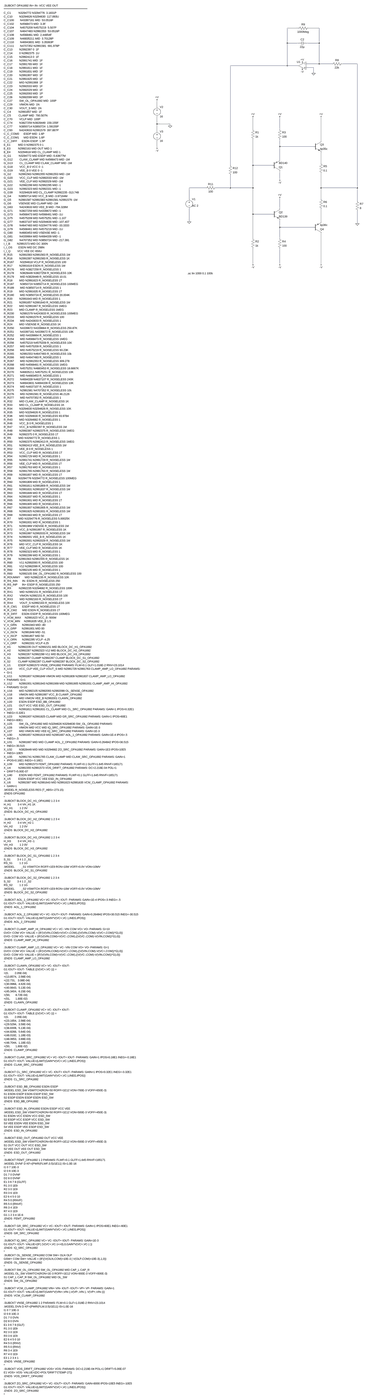
[diagram p0: schematic power stage with dc servo-AC.asc, whole sheet]
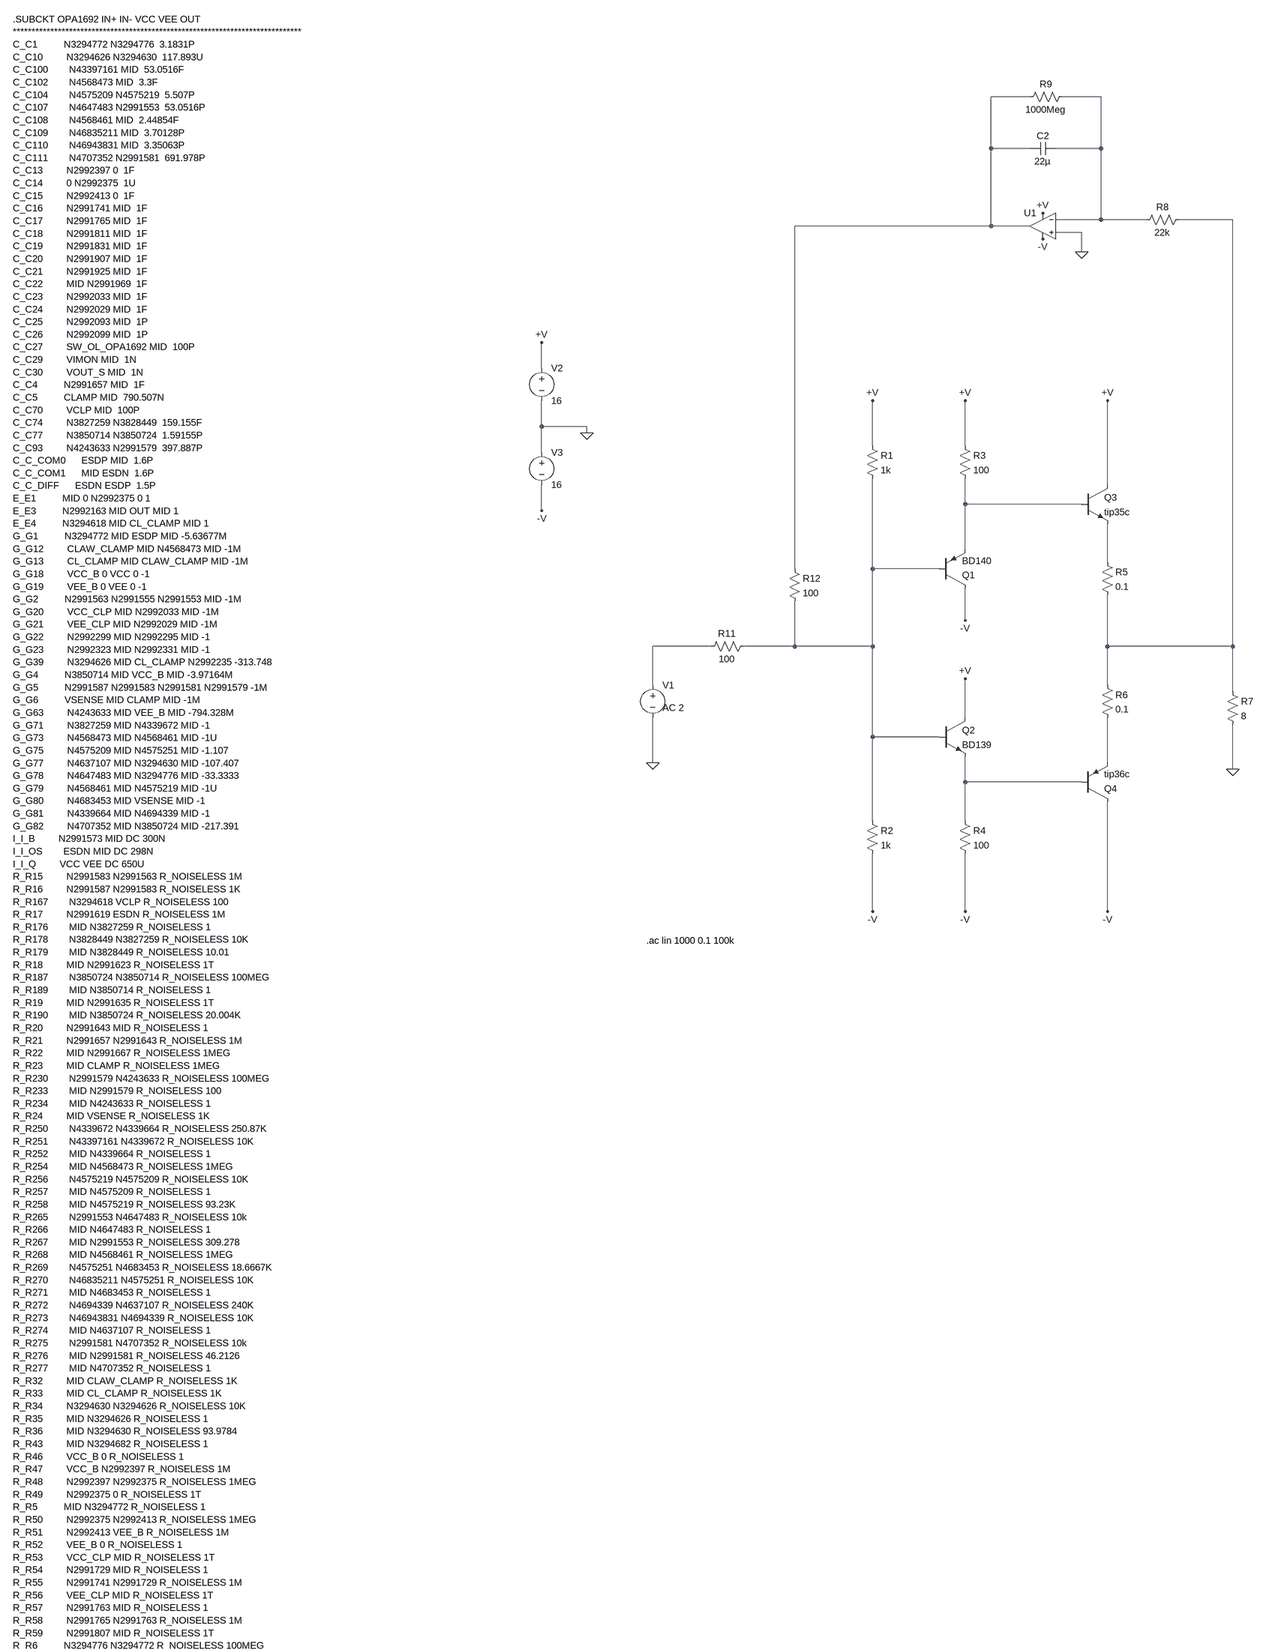
[diagram p1: schematic power stage with dc servo-AC.asc, part, row 1 of 3, column 1 of 1]
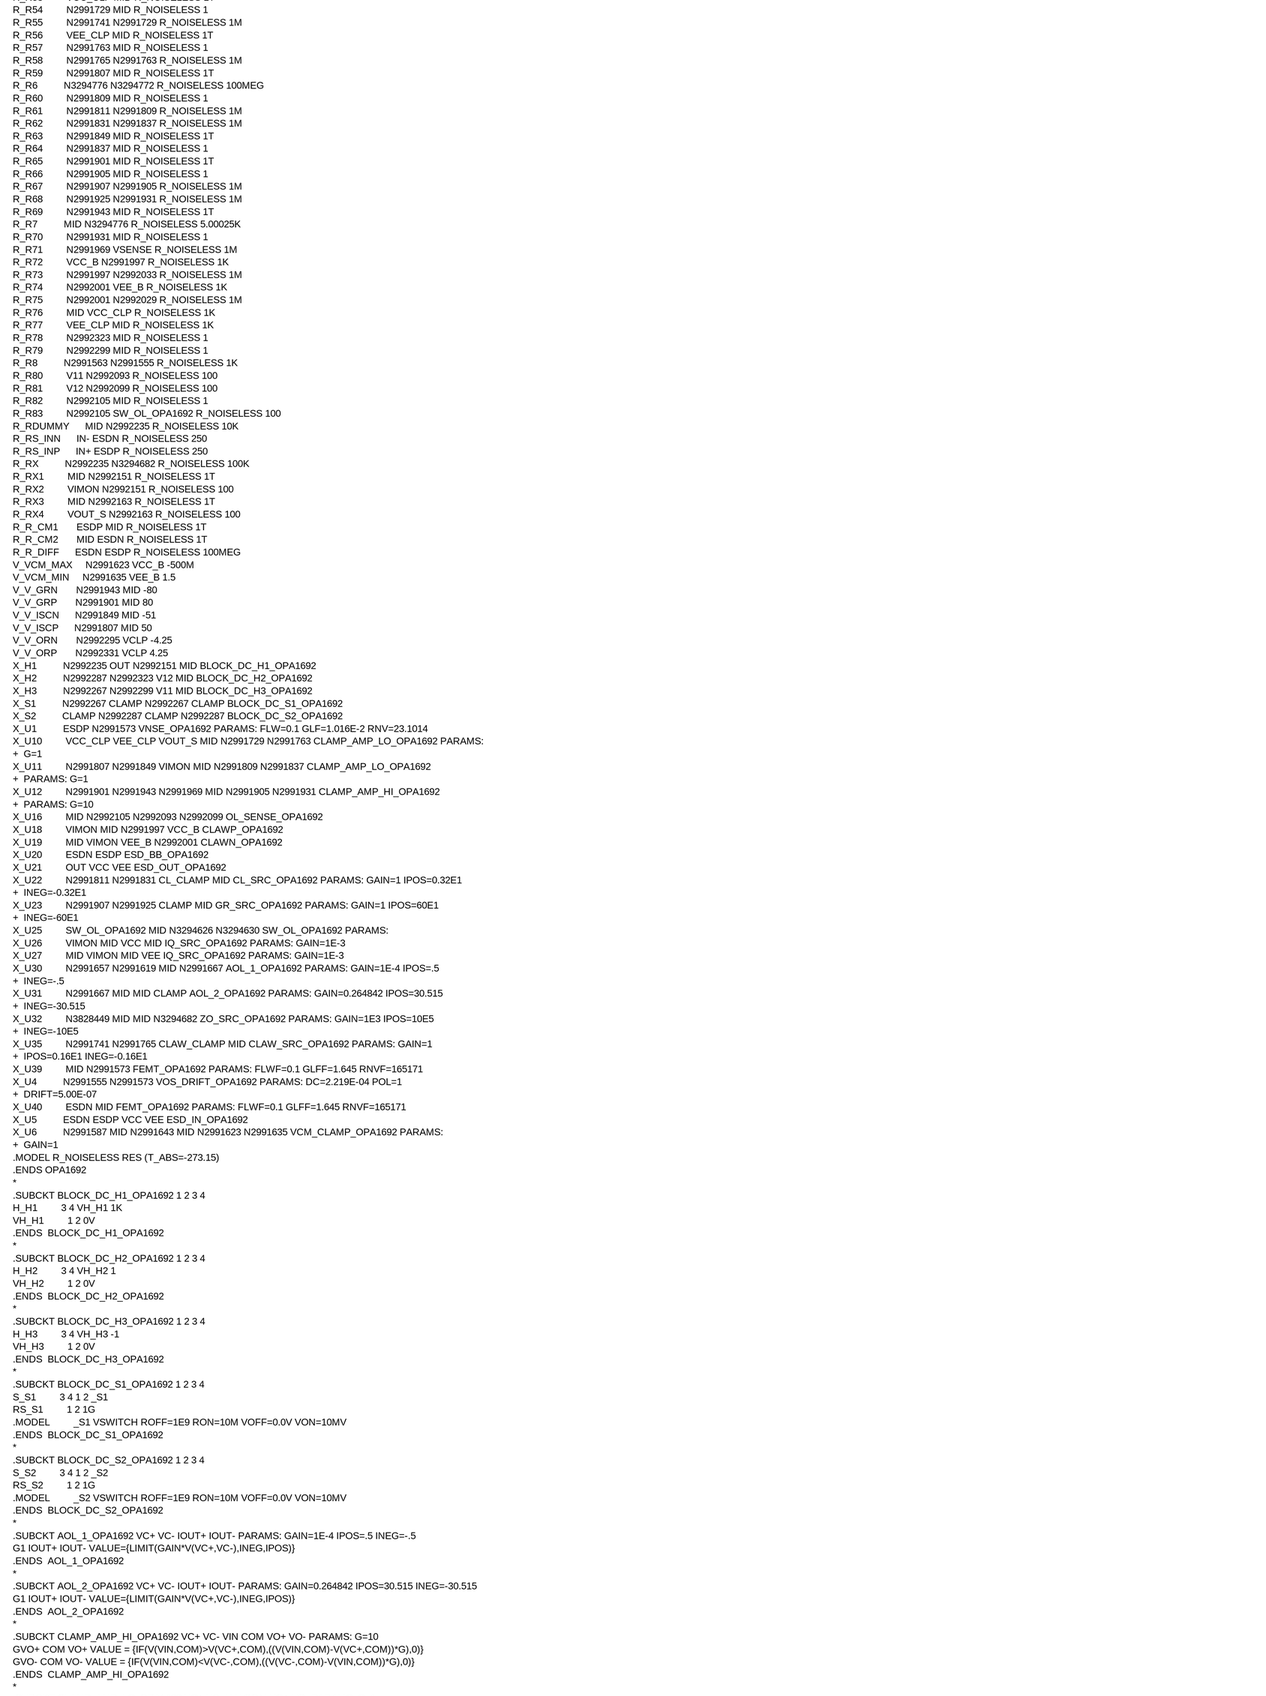
[diagram p2: schematic power stage with dc servo-AC.asc, part, row 2 of 3, column 1 of 1]
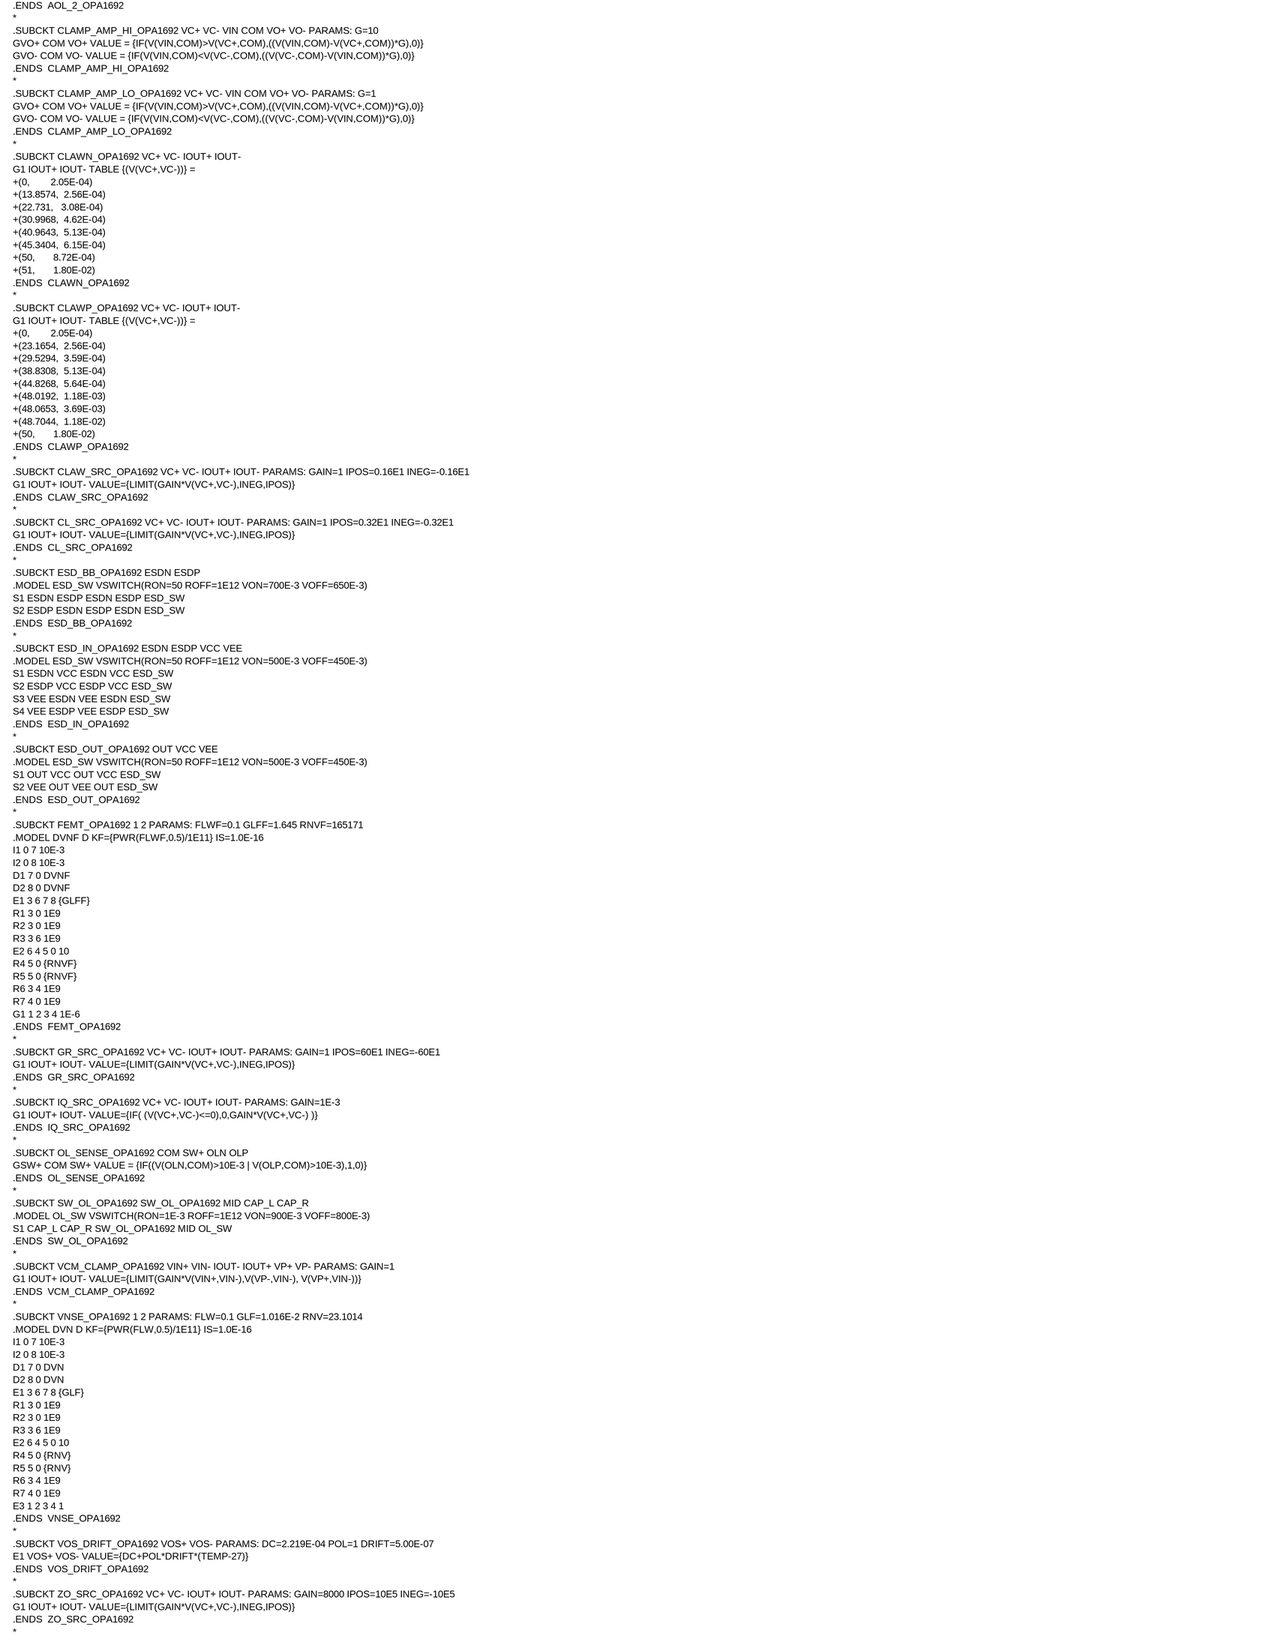
[diagram p3: schematic power stage with dc servo-AC.asc, part, row 3 of 3, column 1 of 1]
power stage with dc servo-AC.asc, the LTspice schematic file:
Version 4
SHEET 1 1560 8548
WIRE 720 -1888 624 -1888
WIRE 896 -1888 800 -1888
WIRE 624 -1760 624 -1888
WIRE 720 -1760 624 -1760
WIRE 896 -1760 896 -1888
WIRE 896 -1760 784 -1760
WIRE 896 -1584 896 -1760
WIRE 896 -1584 784 -1584
WIRE 1008 -1584 896 -1584
WIRE 1504 -1584 1088 -1584
WIRE 624 -1568 624 -1760
WIRE 624 -1568 -64 -1568
WIRE 720 -1568 624 -1568
WIRE 848 -1552 784 -1552
WIRE 848 -1504 848 -1552
WIRE -1408 -1216 -1408 -1280
WIRE -1408 -1072 -1408 -1136
WIRE -1296 -1072 -1408 -1072
WIRE -1296 -1056 -1296 -1072
WIRE 240 -1024 240 -1136
WIRE 560 -1024 560 -1136
WIRE -1408 -1008 -1408 -1072
WIRE 912 -928 912 -1136
WIRE 560 -880 560 -944
WIRE 848 -880 560 -880
WIRE -1408 -864 -1408 -928
WIRE 560 -768 560 -880
WIRE 912 -736 912 -832
WIRE -64 -720 -64 -1568
WIRE 240 -720 240 -944
WIRE 496 -720 240 -720
WIRE 560 -592 560 -672
WIRE -288 -528 -432 -528
WIRE -64 -528 -64 -640
WIRE -64 -528 -208 -528
WIRE 240 -528 240 -720
WIRE 240 -528 -64 -528
WIRE 912 -528 912 -656
WIRE 1504 -528 1504 -1584
WIRE 1504 -528 912 -528
WIRE -432 -432 -432 -528
WIRE 912 -432 912 -528
WIRE 1504 -416 1504 -528
WIRE 560 -352 560 -448
WIRE 240 -304 240 -528
WIRE 496 -304 240 -304
WIRE -432 -240 -432 -352
WIRE 912 -240 912 -352
WIRE 1504 -224 1504 -336
WIRE 560 -192 560 -256
WIRE 848 -192 560 -192
WIRE 240 -96 240 -304
WIRE 560 -96 560 -192
WIRE 240 128 240 -16
WIRE 560 128 560 -16
WIRE 912 128 912 -144
FLAG -432 -240 0
FLAG 240 -1136 +V
FLAG 560 -1136 +V
FLAG 240 128 -V
FLAG 560 128 -V
FLAG 560 -592 -V
FLAG 560 -448 +V
FLAG 912 -1136 +V
FLAG 912 128 -V
FLAG 1504 -224 0
FLAG -1296 -1056 0
FLAG -1408 -1280 +V
FLAG -1408 -864 -V
FLAG 848 -1504 0
FLAG 752 -1600 +V
FLAG 752 -1536 -V
SYMBOL res 224 -1040 R0
SYMATTR InstName R1
SYMATTR Value 1k
SYMATTR SpiceLine tol=1 pwr=0.5
SYMBOL res 224 -112 R0
SYMATTR InstName R2
SYMATTR Value 1k
SYMATTR SpiceLine tol=1 pwr=0.5
SYMBOL pnp 496 -672 M180
SYMATTR InstName Q1
SYMATTR Value BD140
SYMBOL npn 496 -352 R0
SYMATTR InstName Q2
SYMATTR Value BD139
SYMBOL voltage -432 -448 R0
WINDOW 3 24 44 Left 2
WINDOW 123 24 72 Left 2
WINDOW 39 0 0 Left 0
SYMATTR Value ""
SYMATTR Value2 AC 2
SYMATTR InstName V1
SYMBOL res 544 -1040 R0
SYMATTR InstName R3
SYMATTR Value 100
SYMATTR SpiceLine tol=5 pwr=2
SYMBOL res 544 -112 R0
SYMATTR InstName R4
SYMATTR Value 100
SYMATTR SpiceLine tol=5 pwr=5
SYMBOL npn 848 -928 R0
SYMATTR InstName Q3
SYMATTR Value tip35c
SYMBOL pnp 848 -144 M180
SYMATTR InstName Q4
SYMATTR Value tip36c
SYMBOL res 896 -752 R0
SYMATTR InstName R5
SYMATTR Value 0.1
SYMBOL res 896 -448 R0
SYMATTR InstName R6
SYMATTR Value 0.1
SYMBOL res 1488 -432 R0
SYMATTR InstName R7
SYMATTR Value 8
SYMBOL voltage -1408 -1232 R0
WINDOW 123 0 0 Left 0
WINDOW 39 0 0 Left 0
SYMATTR InstName V2
SYMATTR Value 16
SYMBOL voltage -1408 -1024 R0
WINDOW 123 0 0 Left 0
WINDOW 39 0 0 Left 0
SYMATTR InstName V3
SYMATTR Value 16
SYMBOL OpAmps\\opamp2 752 -1632 M0
WINDOW 3 16 96 Invisible 2
SYMATTR Value OPA1692
SYMATTR InstName U1
SYMBOL res 1104 -1600 R90
WINDOW 0 0 56 VBottom 2
WINDOW 3 32 56 VTop 2
SYMATTR InstName R8
SYMATTR Value 22k
SYMBOL res 816 -1904 R90
WINDOW 0 0 56 VBottom 2
WINDOW 3 32 56 VTop 2
SYMATTR InstName R9
SYMATTR Value 1000Meg
SYMBOL cap 784 -1776 R90
WINDOW 0 0 32 VBottom 2
WINDOW 3 32 32 VTop 2
SYMATTR InstName C2
SYMATTR Value 22µ
SYMBOL res -192 -544 R90
WINDOW 0 0 56 VBottom 2
WINDOW 3 32 56 VTop 2
SYMATTR InstName R11
SYMATTR Value 100
SYMBOL res -80 -736 R0
SYMATTR InstName R12
SYMATTR Value 100
TEXT -448 200 Left 2 !.ac lin 1000 0.1 100k
TEXT -3000 -2080 Left 2 !.SUBCKT OPA1692 IN+ IN- VCC VEE OUT  \n*****************************************************************************\nC_C1          N3294772 N3294776  3.1831P   \nC_C10         N3294626 N3294630  117.893U   \nC_C100        N43397161 MID  53.0516F   \nC_C102        N4568473 MID  3.3F   \nC_C104        N4575209 N4575219  5.507P   \nC_C107        N4647483 N2991553  53.0516P   \nC_C108        N4568461 MID  2.44854F   \nC_C109        N46835211 MID  3.70128P   \nC_C110        N46943831 MID  3.35063P   \nC_C111        N4707352 N2991581  691.978P   \nC_C13         N2992397 0  1F   \nC_C14         0 N2992375  1U   \nC_C15         N2992413 0  1F   \nC_C16         N2991741 MID  1F   \nC_C17         N2991765 MID  1F   \nC_C18         N2991811 MID  1F   \nC_C19         N2991831 MID  1F   \nC_C20         N2991907 MID  1F   \nC_C21         N2991925 MID  1F   \nC_C22         MID N2991969  1F   \nC_C23         N2992033 MID  1F   \nC_C24         N2992029 MID  1F   \nC_C25         N2992093 MID  1P   \nC_C26         N2992099 MID  1P   \nC_C27         SW_OL_OPA1692 MID  100P   \nC_C29         VIMON MID  1N   \nC_C30         VOUT_S MID  1N   \nC_C4          N2991657 MID  1F   \nC_C5          CLAMP MID  790.507N   \nC_C70         VCLP MID  100P   \nC_C74         N3827259 N3828449  159.155F   \nC_C77         N3850714 N3850724  1.59155P   \nC_C93         N4243633 N2991579  397.887P   \nC_C_COM0      ESDP MID  1.6P   \nC_C_COM1      MID ESDN  1.6P   \nC_C_DIFF      ESDN ESDP  1.5P   \nE_E1          MID 0 N2992375 0 1\nE_E3          N2992163 MID OUT MID 1\nE_E4          N3294618 MID CL_CLAMP MID 1\nG_G1          N3294772 MID ESDP MID -5.63677M\nG_G12         CLAW_CLAMP MID N4568473 MID -1M\nG_G13         CL_CLAMP MID CLAW_CLAMP MID -1M\nG_G18         VCC_B 0 VCC 0 -1\nG_G19         VEE_B 0 VEE 0 -1\nG_G2          N2991563 N2991555 N2991553 MID -1M\nG_G20         VCC_CLP MID N2992033 MID -1M\nG_G21         VEE_CLP MID N2992029 MID -1M\nG_G22         N2992299 MID N2992295 MID -1\nG_G23         N2992323 MID N2992331 MID -1\nG_G39         N3294626 MID CL_CLAMP N2992235 -313.748\nG_G4          N3850714 MID VCC_B MID -3.97164M\nG_G5          N2991587 N2991583 N2991581 N2991579 -1M\nG_G6          VSENSE MID CLAMP MID -1M\nG_G63         N4243633 MID VEE_B MID -794.328M\nG_G71         N3827259 MID N4339672 MID -1\nG_G73         N4568473 MID N4568461 MID -1U\nG_G75         N4575209 MID N4575251 MID -1.107\nG_G77         N4637107 MID N3294630 MID -107.407\nG_G78         N4647483 MID N3294776 MID -33.3333\nG_G79         N4568461 MID N4575219 MID -1U\nG_G80         N4683453 MID VSENSE MID -1\nG_G81         N4339664 MID N4694339 MID -1\nG_G82         N4707352 MID N3850724 MID -217.391\nI_I_B         N2991573 MID DC 300N  \nI_I_OS        ESDN MID DC 298N  \nI_I_Q         VCC VEE DC 650U  \nR_R15         N2991583 N2991563 R_NOISELESS 1M\nR_R16         N2991587 N2991583 R_NOISELESS 1K\nR_R167        N3294618 VCLP R_NOISELESS 100\nR_R17         N2991619 ESDN R_NOISELESS 1M\nR_R176        MID N3827259 R_NOISELESS 1\nR_R178        N3828449 N3827259 R_NOISELESS 10K\nR_R179        MID N3828449 R_NOISELESS 10.01\nR_R18         MID N2991623 R_NOISELESS 1T\nR_R187        N3850724 N3850714 R_NOISELESS 100MEG\nR_R189        MID N3850714 R_NOISELESS 1\nR_R19         MID N2991635 R_NOISELESS 1T\nR_R190        MID N3850724 R_NOISELESS 20.004K\nR_R20         N2991643 MID R_NOISELESS 1\nR_R21         N2991657 N2991643 R_NOISELESS 1M\nR_R22         MID N2991667 R_NOISELESS 1MEG\nR_R23         MID CLAMP R_NOISELESS 1MEG\nR_R230        N2991579 N4243633 R_NOISELESS 100MEG\nR_R233        MID N2991579 R_NOISELESS 100\nR_R234        MID N4243633 R_NOISELESS 1\nR_R24         MID VSENSE R_NOISELESS 1K\nR_R250        N4339672 N4339664 R_NOISELESS 250.87K\nR_R251        N43397161 N4339672 R_NOISELESS 10K\nR_R252        MID N4339664 R_NOISELESS 1\nR_R254        MID N4568473 R_NOISELESS 1MEG\nR_R256        N4575219 N4575209 R_NOISELESS 10K\nR_R257        MID N4575209 R_NOISELESS 1\nR_R258        MID N4575219 R_NOISELESS 93.23K\nR_R265        N2991553 N4647483 R_NOISELESS 10k\nR_R266        MID N4647483 R_NOISELESS 1\nR_R267        MID N2991553 R_NOISELESS 309.278\nR_R268        MID N4568461 R_NOISELESS 1MEG\nR_R269        N4575251 N4683453 R_NOISELESS 18.6667K\nR_R270        N46835211 N4575251 R_NOISELESS 10K\nR_R271        MID N4683453 R_NOISELESS 1\nR_R272        N4694339 N4637107 R_NOISELESS 240K\nR_R273        N46943831 N4694339 R_NOISELESS 10K\nR_R274        MID N4637107 R_NOISELESS 1\nR_R275        N2991581 N4707352 R_NOISELESS 10k\nR_R276        MID N2991581 R_NOISELESS 46.2126\nR_R277        MID N4707352 R_NOISELESS 1\nR_R32         MID CLAW_CLAMP R_NOISELESS 1K\nR_R33         MID CL_CLAMP R_NOISELESS 1K\nR_R34         N3294630 N3294626 R_NOISELESS 10K\nR_R35         MID N3294626 R_NOISELESS 1\nR_R36         MID N3294630 R_NOISELESS 93.9784\nR_R43         MID N3294682 R_NOISELESS 1\nR_R46         VCC_B 0 R_NOISELESS 1\nR_R47         VCC_B N2992397 R_NOISELESS 1M\nR_R48         N2992397 N2992375 R_NOISELESS 1MEG\nR_R49         N2992375 0 R_NOISELESS 1T\nR_R5          MID N3294772 R_NOISELESS 1\nR_R50         N2992375 N2992413 R_NOISELESS 1MEG\nR_R51         N2992413 VEE_B R_NOISELESS 1M\nR_R52         VEE_B 0 R_NOISELESS 1\nR_R53         VCC_CLP MID R_NOISELESS 1T\nR_R54         N2991729 MID R_NOISELESS 1\nR_R55         N2991741 N2991729 R_NOISELESS 1M\nR_R56         VEE_CLP MID R_NOISELESS 1T\nR_R57         N2991763 MID R_NOISELESS 1\nR_R58         N2991765 N2991763 R_NOISELESS 1M\nR_R59         N2991807 MID R_NOISELESS 1T\nR_R6          N3294776 N3294772 R_NOISELESS 100MEG\nR_R60         N2991809 MID R_NOISELESS 1\nR_R61         N2991811 N2991809 R_NOISELESS 1M\nR_R62         N2991831 N2991837 R_NOISELESS 1M\nR_R63         N2991849 MID R_NOISELESS 1T\nR_R64         N2991837 MID R_NOISELESS 1\nR_R65         N2991901 MID R_NOISELESS 1T\nR_R66         N2991905 MID R_NOISELESS 1\nR_R67         N2991907 N2991905 R_NOISELESS 1M\nR_R68         N2991925 N2991931 R_NOISELESS 1M\nR_R69         N2991943 MID R_NOISELESS 1T\nR_R7          MID N3294776 R_NOISELESS 5.00025K\nR_R70         N2991931 MID R_NOISELESS 1\nR_R71         N2991969 VSENSE R_NOISELESS 1M\nR_R72         VCC_B N2991997 R_NOISELESS 1K\nR_R73         N2991997 N2992033 R_NOISELESS 1M\nR_R74         N2992001 VEE_B R_NOISELESS 1K\nR_R75         N2992001 N2992029 R_NOISELESS 1M\nR_R76         MID VCC_CLP R_NOISELESS 1K\nR_R77         VEE_CLP MID R_NOISELESS 1K\nR_R78         N2992323 MID R_NOISELESS 1\nR_R79         N2992299 MID R_NOISELESS 1\nR_R8          N2991563 N2991555 R_NOISELESS 1K\nR_R80         V11 N2992093 R_NOISELESS 100\nR_R81         V12 N2992099 R_NOISELESS 100\nR_R82         N2992105 MID R_NOISELESS 1\nR_R83         N2992105 SW_OL_OPA1692 R_NOISELESS 100\nR_RDUMMY      MID N2992235 R_NOISELESS 10K\nR_RS_INN      IN- ESDN R_NOISELESS 250\nR_RS_INP      IN+ ESDP R_NOISELESS 250\nR_RX          N2992235 N3294682 R_NOISELESS 100K\nR_RX1         MID N2992151 R_NOISELESS 1T\nR_RX2         VIMON N2992151 R_NOISELESS 100\nR_RX3         MID N2992163 R_NOISELESS 1T\nR_RX4         VOUT_S N2992163 R_NOISELESS 100\nR_R_CM1       ESDP MID R_NOISELESS 1T\nR_R_CM2       MID ESDN R_NOISELESS 1T\nR_R_DIFF      ESDN ESDP R_NOISELESS 100MEG\nV_VCM_MAX     N2991623 VCC_B -500M\nV_VCM_MIN     N2991635 VEE_B 1.5\nV_V_GRN       N2991943 MID -80\nV_V_GRP       N2991901 MID 80\nV_V_ISCN      N2991849 MID -51\nV_V_ISCP      N2991807 MID 50\nV_V_ORN       N2992295 VCLP -4.25\nV_V_ORP       N2992331 VCLP 4.25\nX_H1          N2992235 OUT N2992151 MID BLOCK_DC_H1_OPA1692 \nX_H2          N2992287 N2992323 V12 MID BLOCK_DC_H2_OPA1692 \nX_H3          N2992267 N2992299 V11 MID BLOCK_DC_H3_OPA1692 \nX_S1          N2992267 CLAMP N2992267 CLAMP BLOCK_DC_S1_OPA1692 \nX_S2          CLAMP N2992287 CLAMP N2992287 BLOCK_DC_S2_OPA1692 \nX_U1          ESDP N2991573 VNSE_OPA1692 PARAMS: FLW=0.1 GLF=1.016E-2 RNV=23.1014\nX_U10         VCC_CLP VEE_CLP VOUT_S MID N2991729 N2991763 CLAMP_AMP_LO_OPA1692 PARAMS:\n+  G=1\nX_U11         N2991807 N2991849 VIMON MID N2991809 N2991837 CLAMP_AMP_LO_OPA1692\n+  PARAMS: G=1\nX_U12         N2991901 N2991943 N2991969 MID N2991905 N2991931 CLAMP_AMP_HI_OPA1692\n+  PARAMS: G=10\nX_U16         MID N2992105 N2992093 N2992099 OL_SENSE_OPA1692\nX_U18         VIMON MID N2991997 VCC_B CLAWP_OPA1692\nX_U19         MID VIMON VEE_B N2992001 CLAWN_OPA1692\nX_U20         ESDN ESDP ESD_BB_OPA1692\nX_U21         OUT VCC VEE ESD_OUT_OPA1692\nX_U22         N2991811 N2991831 CL_CLAMP MID CL_SRC_OPA1692 PARAMS: GAIN=1 IPOS=0.32E1\n+  INEG=-0.32E1\nX_U23         N2991907 N2991925 CLAMP MID GR_SRC_OPA1692 PARAMS: GAIN=1 IPOS=60E1\n+  INEG=-60E1\nX_U25         SW_OL_OPA1692 MID N3294626 N3294630 SW_OL_OPA1692 PARAMS:\nX_U26         VIMON MID VCC MID IQ_SRC_OPA1692 PARAMS: GAIN=1E-3\nX_U27         MID VIMON MID VEE IQ_SRC_OPA1692 PARAMS: GAIN=1E-3\nX_U30         N2991657 N2991619 MID N2991667 AOL_1_OPA1692 PARAMS: GAIN=1E-4 IPOS=.5\n+  INEG=-.5\nX_U31         N2991667 MID MID CLAMP AOL_2_OPA1692 PARAMS: GAIN=0.264842 IPOS=30.515\n+  INEG=-30.515\nX_U32         N3828449 MID MID N3294682 ZO_SRC_OPA1692 PARAMS: GAIN=1E3 IPOS=10E5\n+  INEG=-10E5\nX_U35         N2991741 N2991765 CLAW_CLAMP MID CLAW_SRC_OPA1692 PARAMS: GAIN=1\n+  IPOS=0.16E1 INEG=-0.16E1\nX_U39         MID N2991573 FEMT_OPA1692 PARAMS: FLWF=0.1 GLFF=1.645 RNVF=165171\nX_U4          N2991555 N2991573 VOS_DRIFT_OPA1692 PARAMS: DC=2.219E-04 POL=1\n+  DRIFT=5.00E-07\nX_U40         ESDN MID FEMT_OPA1692 PARAMS: FLWF=0.1 GLFF=1.645 RNVF=165171\nX_U5          ESDN ESDP VCC VEE ESD_IN_OPA1692\nX_U6          N2991587 MID N2991643 MID N2991623 N2991635 VCM_CLAMP_OPA1692 PARAMS:\n+  GAIN=1\n.MODEL R_NOISELESS RES (T_ABS=-273.15)\n.ENDS OPA1692\n*\n.SUBCKT BLOCK_DC_H1_OPA1692 1 2 3 4  \nH_H1         3 4 VH_H1 1K\nVH_H1         1 2 0V\n.ENDS  BLOCK_DC_H1_OPA1692\n*\n.SUBCKT BLOCK_DC_H2_OPA1692 1 2 3 4  \nH_H2         3 4 VH_H2 1\nVH_H2         1 2 0V\n.ENDS  BLOCK_DC_H2_OPA1692\n*\n.SUBCKT BLOCK_DC_H3_OPA1692 1 2 3 4  \nH_H3         3 4 VH_H3 -1\nVH_H3         1 2 0V\n.ENDS  BLOCK_DC_H3_OPA1692\n*\n.SUBCKT BLOCK_DC_S1_OPA1692 1 2 3 4  \nS_S1         3 4 1 2 _S1\nRS_S1         1 2 1G\n.MODEL         _S1 VSWITCH ROFF=1E9 RON=10M VOFF=0.0V VON=10MV\n.ENDS  BLOCK_DC_S1_OPA1692\n*\n.SUBCKT BLOCK_DC_S2_OPA1692 1 2 3 4  \nS_S2         3 4 1 2 _S2\nRS_S2         1 2 1G\n.MODEL         _S2 VSWITCH ROFF=1E9 RON=10M VOFF=0.0V VON=10MV\n.ENDS  BLOCK_DC_S2_OPA1692\n*\n.SUBCKT AOL_1_OPA1692 VC+ VC- IOUT+ IOUT- PARAMS: GAIN=1E-4 IPOS=.5 INEG=-.5\nG1 IOUT+ IOUT- VALUE={LIMIT(GAIN*V(VC+,VC-),INEG,IPOS)}\n.ENDS  AOL_1_OPA1692\n*\n.SUBCKT AOL_2_OPA1692 VC+ VC- IOUT+ IOUT- PARAMS: GAIN=0.264842 IPOS=30.515 INEG=-30.515\nG1 IOUT+ IOUT- VALUE={LIMIT(GAIN*V(VC+,VC-),INEG,IPOS)}\n.ENDS  AOL_2_OPA1692\n*\n.SUBCKT CLAMP_AMP_HI_OPA1692 VC+ VC- VIN COM VO+ VO- PARAMS: G=10\nGVO+ COM VO+ VALUE = {IF(V(VIN,COM)>V(VC+,COM),((V(VIN,COM)-V(VC+,COM))*G),0)}\nGVO- COM VO- VALUE = {IF(V(VIN,COM)<V(VC-,COM),((V(VC-,COM)-V(VIN,COM))*G),0)}\n.ENDS  CLAMP_AMP_HI_OPA1692\n*\n.SUBCKT CLAMP_AMP_LO_OPA1692 VC+ VC- VIN COM VO+ VO- PARAMS: G=1\nGVO+ COM VO+ VALUE = {IF(V(VIN,COM)>V(VC+,COM),((V(VIN,COM)-V(VC+,COM))*G),0)}\nGVO- COM VO- VALUE = {IF(V(VIN,COM)<V(VC-,COM),((V(VC-,COM)-V(VIN,COM))*G),0)}\n.ENDS  CLAMP_AMP_LO_OPA1692\n*\n.SUBCKT CLAWN_OPA1692 VC+ VC- IOUT+ IOUT-\nG1 IOUT+ IOUT- TABLE {(V(VC+,VC-))} =\n+(0,        2.05E-04)\n+(13.8574,  2.56E-04)\n+(22.731,   3.08E-04)\n+(30.9968,  4.62E-04)\n+(40.9643,  5.13E-04)\n+(45.3404,  6.15E-04)\n+(50,       8.72E-04)\n+(51,       1.80E-02)\n.ENDS  CLAWN_OPA1692\n*\n.SUBCKT CLAWP_OPA1692 VC+ VC- IOUT+ IOUT-\nG1 IOUT+ IOUT- TABLE {(V(VC+,VC-))} =\n+(0,        2.05E-04)\n+(23.1654,  2.56E-04)\n+(29.5294,  3.59E-04)\n+(38.8308,  5.13E-04)\n+(44.8268,  5.64E-04)\n+(48.0192,  1.18E-03)\n+(48.0653,  3.69E-03)\n+(48.7044,  1.18E-02)\n+(50,       1.80E-02)\n.ENDS  CLAWP_OPA1692\n*\n.SUBCKT CLAW_SRC_OPA1692 VC+ VC- IOUT+ IOUT- PARAMS: GAIN=1 IPOS=0.16E1 INEG=-0.16E1\nG1 IOUT+ IOUT- VALUE={LIMIT(GAIN*V(VC+,VC-),INEG,IPOS)}\n.ENDS  CLAW_SRC_OPA1692\n*\n.SUBCKT CL_SRC_OPA1692 VC+ VC- IOUT+ IOUT- PARAMS: GAIN=1 IPOS=0.32E1 INEG=-0.32E1\nG1 IOUT+ IOUT- VALUE={LIMIT(GAIN*V(VC+,VC-),INEG,IPOS)}\n.ENDS  CL_SRC_OPA1692\n*\n.SUBCKT ESD_BB_OPA1692 ESDN ESDP\n.MODEL ESD_SW VSWITCH(RON=50 ROFF=1E12 VON=700E-3 VOFF=650E-3)\nS1 ESDN ESDP ESDN ESDP ESD_SW\nS2 ESDP ESDN ESDP ESDN ESD_SW\n.ENDS  ESD_BB_OPA1692\n*\n.SUBCKT ESD_IN_OPA1692 ESDN ESDP VCC VEE\n.MODEL ESD_SW VSWITCH(RON=50 ROFF=1E12 VON=500E-3 VOFF=450E-3)\nS1 ESDN VCC ESDN VCC ESD_SW\nS2 ESDP VCC ESDP VCC ESD_SW\nS3 VEE ESDN VEE ESDN ESD_SW\nS4 VEE ESDP VEE ESDP ESD_SW\n.ENDS  ESD_IN_OPA1692\n*\n.SUBCKT ESD_OUT_OPA1692 OUT VCC VEE\n.MODEL ESD_SW VSWITCH(RON=50 ROFF=1E12 VON=500E-3 VOFF=450E-3)\nS1 OUT VCC OUT VCC ESD_SW\nS2 VEE OUT VEE OUT ESD_SW\n.ENDS  ESD_OUT_OPA1692\n*\n.SUBCKT FEMT_OPA1692 1 2 PARAMS: FLWF=0.1 GLFF=1.645 RNVF=165171\n.MODEL DVNF D KF={PWR(FLWF,0.5)/1E11} IS=1.0E-16\nI1 0 7 10E-3\nI2 0 8 10E-3\nD1 7 0 DVNF\nD2 8 0 DVNF\nE1 3 6 7 8 {GLFF}\nR1 3 0 1E9\nR2 3 0 1E9\nR3 3 6 1E9\nE2 6 4 5 0 10\nR4 5 0 {RNVF}\nR5 5 0 {RNVF}\nR6 3 4 1E9\nR7 4 0 1E9\nG1 1 2 3 4 1E-6\n.ENDS  FEMT_OPA1692\n*\n.SUBCKT GR_SRC_OPA1692 VC+ VC- IOUT+ IOUT- PARAMS: GAIN=1 IPOS=60E1 INEG=-60E1\nG1 IOUT+ IOUT- VALUE={LIMIT(GAIN*V(VC+,VC-),INEG,IPOS)}\n.ENDS  GR_SRC_OPA1692\n*\n.SUBCKT IQ_SRC_OPA1692 VC+ VC- IOUT+ IOUT- PARAMS: GAIN=1E-3\nG1 IOUT+ IOUT- VALUE={IF( (V(VC+,VC-)<=0),0,GAIN*V(VC+,VC-) )}\n.ENDS  IQ_SRC_OPA1692\n*\n.SUBCKT OL_SENSE_OPA1692 COM SW+ OLN OLP\nGSW+ COM SW+ VALUE = {IF((V(OLN,COM)>10E-3 | V(OLP,COM)>10E-3),1,0)}\n.ENDS  OL_SENSE_OPA1692\n*\n.SUBCKT SW_OL_OPA1692 SW_OL_OPA1692 MID CAP_L CAP_R\n.MODEL OL_SW VSWITCH(RON=1E-3 ROFF=1E12 VON=900E-3 VOFF=800E-3)\nS1 CAP_L CAP_R SW_OL_OPA1692 MID OL_SW\n.ENDS  SW_OL_OPA1692\n*\n.SUBCKT VCM_CLAMP_OPA1692 VIN+ VIN- IOUT- IOUT+ VP+ VP- PARAMS: GAIN=1\nG1 IOUT+ IOUT- VALUE={LIMIT(GAIN*V(VIN+,VIN-),V(VP-,VIN-), V(VP+,VIN-))}\n.ENDS  VCM_CLAMP_OPA1692\n*\n.SUBCKT VNSE_OPA1692 1 2 PARAMS: FLW=0.1 GLF=1.016E-2 RNV=23.1014\n.MODEL DVN D KF={PWR(FLW,0.5)/1E11} IS=1.0E-16\nI1 0 7 10E-3\nI2 0 8 10E-3\nD1 7 0 DVN\nD2 8 0 DVN\nE1 3 6 7 8 {GLF}\nR1 3 0 1E9\nR2 3 0 1E9\nR3 3 6 1E9\nE2 6 4 5 0 10\nR4 5 0 {RNV}\nR5 5 0 {RNV}\nR6 3 4 1E9\nR7 4 0 1E9\nE3 1 2 3 4 1\n.ENDS  VNSE_OPA1692\n*\n.SUBCKT VOS_DRIFT_OPA1692 VOS+ VOS- PARAMS: DC=2.219E-04 POL=1 DRIFT=5.00E-07\nE1 VOS+ VOS- VALUE={DC+POL*DRIFT*(TEMP-27)}\n.ENDS  VOS_DRIFT_OPA1692\n*\n.SUBCKT ZO_SRC_OPA1692 VC+ VC- IOUT+ IOUT- PARAMS: GAIN=8000 IPOS=10E5 INEG=-10E5\nG1 IOUT+ IOUT- VALUE={LIMIT(GAIN*V(VC+,VC-),INEG,IPOS)}\n.ENDS  ZO_SRC_OPA1692\n*

The netlist it stands for:
* power stage with dc servo-AC.asc
R1 +V N006 1k tol=1 pwr=0.5
R2 N006 -V 1k tol=1 pwr=0.5
Q1 -V N006 N004 0 BD140
Q2 +V N006 N009 0 BD139
V1 N007 0 AC 2
R3 +V N004 100 tol=5 pwr=2
R4 N009 -V 100 tol=5 pwr=5
Q3 +V N004 N005 0 tip35c
Q4 -V N009 N008 0 tip36c
R5 N005 N003 0.1
R6 N003 N008 0.1
R7 N003 0 8
V2 +V 0 16
V3 0 -V 16
XU1 0 N002 +V -V N001 OPA1692  ; pins In+ In- V+ V- OUT
R8 N003 N002 22k
R9 N002 N001 1000Meg
C2 N002 N001 22µ
R11 N006 N007 100
R12 N001 N006 100
.model NPN NPN
.model PNP PNP
.lib standard.bjt
.ac lin 1000 0.1 100k
.SUBCKT OPA1692 IN+ IN- VCC VEE OUT
*****************************************************************************
C_C1          N3294772 N3294776  3.1831P
C_C10         N3294626 N3294630  117.893U
C_C100        N43397161 MID  53.0516F
C_C102        N4568473 MID  3.3F
C_C104        N4575209 N4575219  5.507P
C_C107        N4647483 N2991553  53.0516P
C_C108        N4568461 MID  2.44854F
C_C109        N46835211 MID  3.70128P
C_C110        N46943831 MID  3.35063P
C_C111        N4707352 N2991581  691.978P
C_C13         N2992397 0  1F
C_C14         0 N2992375  1U
C_C15         N2992413 0  1F
C_C16         N2991741 MID  1F
C_C17         N2991765 MID  1F
C_C18         N2991811 MID  1F
C_C19         N2991831 MID  1F
C_C20         N2991907 MID  1F
C_C21         N2991925 MID  1F
C_C22         MID N2991969  1F
C_C23         N2992033 MID  1F
C_C24         N2992029 MID  1F
C_C25         N2992093 MID  1P
C_C26         N2992099 MID  1P
C_C27         SW_OL_OPA1692 MID  100P
C_C29         VIMON MID  1N
C_C30         VOUT_S MID  1N
C_C4          N2991657 MID  1F
C_C5          CLAMP MID  790.507N
C_C70         VCLP MID  100P
C_C74         N3827259 N3828449  159.155F
C_C77         N3850714 N3850724  1.59155P
C_C93         N4243633 N2991579  397.887P
C_C_COM0      ESDP MID  1.6P
C_C_COM1      MID ESDN  1.6P
C_C_DIFF      ESDN ESDP  1.5P
E_E1          MID 0 N2992375 0 1
E_E3          N2992163 MID OUT MID 1
E_E4          N3294618 MID CL_CLAMP MID 1
G_G1          N3294772 MID ESDP MID -5.63677M
G_G12         CLAW_CLAMP MID N4568473 MID -1M
G_G13         CL_CLAMP MID CLAW_CLAMP MID -1M
G_G18         VCC_B 0 VCC 0 -1
G_G19         VEE_B 0 VEE 0 -1
G_G2          N2991563 N2991555 N2991553 MID -1M
G_G20         VCC_CLP MID N2992033 MID -1M
G_G21         VEE_CLP MID N2992029 MID -1M
G_G22         N2992299 MID N2992295 MID -1
G_G23         N2992323 MID N2992331 MID -1
G_G39         N3294626 MID CL_CLAMP N2992235 -313.748
G_G4          N3850714 MID VCC_B MID -3.97164M
G_G5          N2991587 N2991583 N2991581 N2991579 -1M
G_G6          VSENSE MID CLAMP MID -1M
G_G63         N4243633 MID VEE_B MID -794.328M
G_G71         N3827259 MID N4339672 MID -1
G_G73         N4568473 MID N4568461 MID -1U
G_G75         N4575209 MID N4575251 MID -1.107
G_G77         N4637107 MID N3294630 MID -107.407
G_G78         N4647483 MID N3294776 MID -33.3333
G_G79         N4568461 MID N4575219 MID -1U
G_G80         N4683453 MID VSENSE MID -1
G_G81         N4339664 MID N4694339 MID -1
G_G82         N4707352 MID N3850724 MID -217.391
I_I_B         N2991573 MID DC 300N
I_I_OS        ESDN MID DC 298N
I_I_Q         VCC VEE DC 650U
R_R15         N2991583 N2991563 R_NOISELESS 1M
R_R16         N2991587 N2991583 R_NOISELESS 1K
R_R167        N3294618 VCLP R_NOISELESS 100
R_R17         N2991619 ESDN R_NOISELESS 1M
R_R176        MID N3827259 R_NOISELESS 1
R_R178        N3828449 N3827259 R_NOISELESS 10K
R_R179        MID N3828449 R_NOISELESS 10.01
R_R18         MID N2991623 R_NOISELESS 1T
R_R187        N3850724 N3850714 R_NOISELESS 100MEG
R_R189        MID N3850714 R_NOISELESS 1
R_R19         MID N2991635 R_NOISELESS 1T
R_R190        MID N3850724 R_NOISELESS 20.004K
R_R20         N2991643 MID R_NOISELESS 1
R_R21         N2991657 N2991643 R_NOISELESS 1M
R_R22         MID N2991667 R_NOISELESS 1MEG
R_R23         MID CLAMP R_NOISELESS 1MEG
R_R230        N2991579 N4243633 R_NOISELESS 100MEG
R_R233        MID N2991579 R_NOISELESS 100
R_R234        MID N4243633 R_NOISELESS 1
R_R24         MID VSENSE R_NOISELESS 1K
R_R250        N4339672 N4339664 R_NOISELESS 250.87K
R_R251        N43397161 N4339672 R_NOISELESS 10K
R_R252        MID N4339664 R_NOISELESS 1
R_R254        MID N4568473 R_NOISELESS 1MEG
R_R256        N4575219 N4575209 R_NOISELESS 10K
R_R257        MID N4575209 R_NOISELESS 1
R_R258        MID N4575219 R_NOISELESS 93.23K
R_R265        N2991553 N4647483 R_NOISELESS 10k
R_R266        MID N4647483 R_NOISELESS 1
R_R267        MID N2991553 R_NOISELESS 309.278
R_R268        MID N4568461 R_NOISELESS 1MEG
R_R269        N4575251 N4683453 R_NOISELESS 18.6667K
R_R270        N46835211 N4575251 R_NOISELESS 10K
R_R271        MID N4683453 R_NOISELESS 1
R_R272        N4694339 N4637107 R_NOISELESS 240K
R_R273        N46943831 N4694339 R_NOISELESS 10K
R_R274        MID N4637107 R_NOISELESS 1
R_R275        N2991581 N4707352 R_NOISELESS 10k
R_R276        MID N2991581 R_NOISELESS 46.2126
R_R277        MID N4707352 R_NOISELESS 1
R_R32         MID CLAW_CLAMP R_NOISELESS 1K
R_R33         MID CL_CLAMP R_NOISELESS 1K
R_R34         N3294630 N3294626 R_NOISELESS 10K
R_R35         MID N3294626 R_NOISELESS 1
R_R36         MID N3294630 R_NOISELESS 93.9784
R_R43         MID N3294682 R_NOISELESS 1
R_R46         VCC_B 0 R_NOISELESS 1
R_R47         VCC_B N2992397 R_NOISELESS 1M
R_R48         N2992397 N2992375 R_NOISELESS 1MEG
R_R49         N2992375 0 R_NOISELESS 1T
R_R5          MID N3294772 R_NOISELESS 1
R_R50         N2992375 N2992413 R_NOISELESS 1MEG
R_R51         N2992413 VEE_B R_NOISELESS 1M
R_R52         VEE_B 0 R_NOISELESS 1
R_R53         VCC_CLP MID R_NOISELESS 1T
R_R54         N2991729 MID R_NOISELESS 1
R_R55         N2991741 N2991729 R_NOISELESS 1M
R_R56         VEE_CLP MID R_NOISELESS 1T
R_R57         N2991763 MID R_NOISELESS 1
R_R58         N2991765 N2991763 R_NOISELESS 1M
R_R59         N2991807 MID R_NOISELESS 1T
R_R6          N3294776 N3294772 R_NOISELESS 100MEG
R_R60         N2991809 MID R_NOISELESS 1
R_R61         N2991811 N2991809 R_NOISELESS 1M
R_R62         N2991831 N2991837 R_NOISELESS 1M
R_R63         N2991849 MID R_NOISELESS 1T
R_R64         N2991837 MID R_NOISELESS 1
R_R65         N2991901 MID R_NOISELESS 1T
R_R66         N2991905 MID R_NOISELESS 1
R_R67         N2991907 N2991905 R_NOISELESS 1M
R_R68         N2991925 N2991931 R_NOISELESS 1M
R_R69         N2991943 MID R_NOISELESS 1T
R_R7          MID N3294776 R_NOISELESS 5.00025K
R_R70         N2991931 MID R_NOISELESS 1
R_R71         N2991969 VSENSE R_NOISELESS 1M
R_R72         VCC_B N2991997 R_NOISELESS 1K
R_R73         N2991997 N2992033 R_NOISELESS 1M
R_R74         N2992001 VEE_B R_NOISELESS 1K
R_R75         N2992001 N2992029 R_NOISELESS 1M
R_R76         MID VCC_CLP R_NOISELESS 1K
R_R77         VEE_CLP MID R_NOISELESS 1K
R_R78         N2992323 MID R_NOISELESS 1
R_R79         N2992299 MID R_NOISELESS 1
R_R8          N2991563 N2991555 R_NOISELESS 1K
R_R80         V11 N2992093 R_NOISELESS 100
R_R81         V12 N2992099 R_NOISELESS 100
R_R82         N2992105 MID R_NOISELESS 1
R_R83         N2992105 SW_OL_OPA1692 R_NOISELESS 100
R_RDUMMY      MID N2992235 R_NOISELESS 10K
R_RS_INN      IN- ESDN R_NOISELESS 250
R_RS_INP      IN+ ESDP R_NOISELESS 250
R_RX          N2992235 N3294682 R_NOISELESS 100K
R_RX1         MID N2992151 R_NOISELESS 1T
R_RX2         VIMON N2992151 R_NOISELESS 100
R_RX3         MID N2992163 R_NOISELESS 1T
R_RX4         VOUT_S N2992163 R_NOISELESS 100
R_R_CM1       ESDP MID R_NOISELESS 1T
R_R_CM2       MID ESDN R_NOISELESS 1T
R_R_DIFF      ESDN ESDP R_NOISELESS 100MEG
V_VCM_MAX     N2991623 VCC_B -500M
V_VCM_MIN     N2991635 VEE_B 1.5
V_V_GRN       N2991943 MID -80
V_V_GRP       N2991901 MID 80
V_V_ISCN      N2991849 MID -51
V_V_ISCP      N2991807 MID 50
V_V_ORN       N2992295 VCLP -4.25
V_V_ORP       N2992331 VCLP 4.25
X_H1          N2992235 OUT N2992151 MID BLOCK_DC_H1_OPA1692
X_H2          N2992287 N2992323 V12 MID BLOCK_DC_H2_OPA1692
X_H3          N2992267 N2992299 V11 MID BLOCK_DC_H3_OPA1692
X_S1          N2992267 CLAMP N2992267 CLAMP BLOCK_DC_S1_OPA1692
X_S2          CLAMP N2992287 CLAMP N2992287 BLOCK_DC_S2_OPA1692
X_U1          ESDP N2991573 VNSE_OPA1692 PARAMS: FLW=0.1 GLF=1.016E-2 RNV=23.1014
X_U10         VCC_CLP VEE_CLP VOUT_S MID N2991729 N2991763 CLAMP_AMP_LO_OPA1692 PARAMS:
+  G=1
X_U11         N2991807 N2991849 VIMON MID N2991809 N2991837 CLAMP_AMP_LO_OPA1692
+  PARAMS: G=1
X_U12         N2991901 N2991943 N2991969 MID N2991905 N2991931 CLAMP_AMP_HI_OPA1692
+  PARAMS: G=10
X_U16         MID N2992105 N2992093 N2992099 OL_SENSE_OPA1692
X_U18         VIMON MID N2991997 VCC_B CLAWP_OPA1692
X_U19         MID VIMON VEE_B N2992001 CLAWN_OPA1692
X_U20         ESDN ESDP ESD_BB_OPA1692
X_U21         OUT VCC VEE ESD_OUT_OPA1692
X_U22         N2991811 N2991831 CL_CLAMP MID CL_SRC_OPA1692 PARAMS: GAIN=1 IPOS=0.32E1
+  INEG=-0.32E1
X_U23         N2991907 N2991925 CLAMP MID GR_SRC_OPA1692 PARAMS: GAIN=1 IPOS=60E1
+  INEG=-60E1
X_U25         SW_OL_OPA1692 MID N3294626 N3294630 SW_OL_OPA1692 PARAMS:
X_U26         VIMON MID VCC MID IQ_SRC_OPA1692 PARAMS: GAIN=1E-3
X_U27         MID VIMON MID VEE IQ_SRC_OPA1692 PARAMS: GAIN=1E-3
X_U30         N2991657 N2991619 MID N2991667 AOL_1_OPA1692 PARAMS: GAIN=1E-4 IPOS=.5
+  INEG=-.5
X_U31         N2991667 MID MID CLAMP AOL_2_OPA1692 PARAMS: GAIN=0.264842 IPOS=30.515
+  INEG=-30.515
X_U32         N3828449 MID MID N3294682 ZO_SRC_OPA1692 PARAMS: GAIN=1E3 IPOS=10E5
+  INEG=-10E5
X_U35         N2991741 N2991765 CLAW_CLAMP MID CLAW_SRC_OPA1692 PARAMS: GAIN=1
+  IPOS=0.16E1 INEG=-0.16E1
X_U39         MID N2991573 FEMT_OPA1692 PARAMS: FLWF=0.1 GLFF=1.645 RNVF=165171
X_U4          N2991555 N2991573 VOS_DRIFT_OPA1692 PARAMS: DC=2.219E-04 POL=1
+  DRIFT=5.00E-07
X_U40         ESDN MID FEMT_OPA1692 PARAMS: FLWF=0.1 GLFF=1.645 RNVF=165171
X_U5          ESDN ESDP VCC VEE ESD_IN_OPA1692
X_U6          N2991587 MID N2991643 MID N2991623 N2991635 VCM_CLAMP_OPA1692 PARAMS:
+  GAIN=1
.MODEL R_NOISELESS RES (T_ABS=-273.15)
.ENDS OPA1692
*
.SUBCKT BLOCK_DC_H1_OPA1692 1 2 3 4
H_H1         3 4 VH_H1 1K
VH_H1         1 2 0V
.ENDS  BLOCK_DC_H1_OPA1692
*
.SUBCKT BLOCK_DC_H2_OPA1692 1 2 3 4
H_H2         3 4 VH_H2 1
VH_H2         1 2 0V
.ENDS  BLOCK_DC_H2_OPA1692
*
.SUBCKT BLOCK_DC_H3_OPA1692 1 2 3 4
H_H3         3 4 VH_H3 -1
VH_H3         1 2 0V
.ENDS  BLOCK_DC_H3_OPA1692
*
.SUBCKT BLOCK_DC_S1_OPA1692 1 2 3 4
S_S1         3 4 1 2 _S1
RS_S1         1 2 1G
.MODEL         _S1 VSWITCH ROFF=1E9 RON=10M VOFF=0.0V VON=10MV
.ENDS  BLOCK_DC_S1_OPA1692
*
.SUBCKT BLOCK_DC_S2_OPA1692 1 2 3 4
S_S2         3 4 1 2 _S2
RS_S2         1 2 1G
.MODEL         _S2 VSWITCH ROFF=1E9 RON=10M VOFF=0.0V VON=10MV
.ENDS  BLOCK_DC_S2_OPA1692
*
.SUBCKT AOL_1_OPA1692 VC+ VC- IOUT+ IOUT- PARAMS: GAIN=1E-4 IPOS=.5 INEG=-.5
G1 IOUT+ IOUT- VALUE={LIMIT(GAIN*V(VC+,VC-),INEG,IPOS)}
.ENDS  AOL_1_OPA1692
*
.SUBCKT AOL_2_OPA1692 VC+ VC- IOUT+ IOUT- PARAMS: GAIN=0.264842 IPOS=30.515 INEG=-30.515
G1 IOUT+ IOUT- VALUE={LIMIT(GAIN*V(VC+,VC-),INEG,IPOS)}
.ENDS  AOL_2_OPA1692
*
.SUBCKT CLAMP_AMP_HI_OPA1692 VC+ VC- VIN COM VO+ VO- PARAMS: G=10
GVO+ COM VO+ VALUE = {IF(V(VIN,COM)>V(VC+,COM),((V(VIN,COM)-V(VC+,COM))*G),0)}
GVO- COM VO- VALUE = {IF(V(VIN,COM)<V(VC-,COM),((V(VC-,COM)-V(VIN,COM))*G),0)}
.ENDS  CLAMP_AMP_HI_OPA1692
*
.SUBCKT CLAMP_AMP_LO_OPA1692 VC+ VC- VIN COM VO+ VO- PARAMS: G=1
GVO+ COM VO+ VALUE = {IF(V(VIN,COM)>V(VC+,COM),((V(VIN,COM)-V(VC+,COM))*G),0)}
GVO- COM VO- VALUE = {IF(V(VIN,COM)<V(VC-,COM),((V(VC-,COM)-V(VIN,COM))*G),0)}
.ENDS  CLAMP_AMP_LO_OPA1692
*
.SUBCKT CLAWN_OPA1692 VC+ VC- IOUT+ IOUT-
G1 IOUT+ IOUT- TABLE {(V(VC+,VC-))} =
+(0,        2.05E-04)
+(13.8574,  2.56E-04)
+(22.731,   3.08E-04)
+(30.9968,  4.62E-04)
+(40.9643,  5.13E-04)
+(45.3404,  6.15E-04)
+(50,       8.72E-04)
+(51,       1.80E-02)
.ENDS  CLAWN_OPA1692
*
.SUBCKT CLAWP_OPA1692 VC+ VC- IOUT+ IOUT-
G1 IOUT+ IOUT- TABLE {(V(VC+,VC-))} =
+(0,        2.05E-04)
+(23.1654,  2.56E-04)
+(29.5294,  3.59E-04)
+(38.8308,  5.13E-04)
+(44.8268,  5.64E-04)
+(48.0192,  1.18E-03)
+(48.0653,  3.69E-03)
+(48.7044,  1.18E-02)
+(50,       1.80E-02)
.ENDS  CLAWP_OPA1692
*
.SUBCKT CLAW_SRC_OPA1692 VC+ VC- IOUT+ IOUT- PARAMS: GAIN=1 IPOS=0.16E1 INEG=-0.16E1
G1 IOUT+ IOUT- VALUE={LIMIT(GAIN*V(VC+,VC-),INEG,IPOS)}
.ENDS  CLAW_SRC_OPA1692
*
.SUBCKT CL_SRC_OPA1692 VC+ VC- IOUT+ IOUT- PARAMS: GAIN=1 IPOS=0.32E1 INEG=-0.32E1
G1 IOUT+ IOUT- VALUE={LIMIT(GAIN*V(VC+,VC-),INEG,IPOS)}
.ENDS  CL_SRC_OPA1692
*
.SUBCKT ESD_BB_OPA1692 ESDN ESDP
.MODEL ESD_SW VSWITCH(RON=50 ROFF=1E12 VON=700E-3 VOFF=650E-3)
S1 ESDN ESDP ESDN ESDP ESD_SW
S2 ESDP ESDN ESDP ESDN ESD_SW
.ENDS  ESD_BB_OPA1692
*
.SUBCKT ESD_IN_OPA1692 ESDN ESDP VCC VEE
.MODEL ESD_SW VSWITCH(RON=50 ROFF=1E12 VON=500E-3 VOFF=450E-3)
S1 ESDN VCC ESDN VCC ESD_SW
S2 ESDP VCC ESDP VCC ESD_SW
S3 VEE ESDN VEE ESDN ESD_SW
S4 VEE ESDP VEE ESDP ESD_SW
.ENDS  ESD_IN_OPA1692
*
.SUBCKT ESD_OUT_OPA1692 OUT VCC VEE
.MODEL ESD_SW VSWITCH(RON=50 ROFF=1E12 VON=500E-3 VOFF=450E-3)
S1 OUT VCC OUT VCC ESD_SW
S2 VEE OUT VEE OUT ESD_SW
.ENDS  ESD_OUT_OPA1692
*
.SUBCKT FEMT_OPA1692 1 2 PARAMS: FLWF=0.1 GLFF=1.645 RNVF=165171
.MODEL DVNF D KF={PWR(FLWF,0.5)/1E11} IS=1.0E-16
I1 0 7 10E-3
I2 0 8 10E-3
D1 7 0 DVNF
D2 8 0 DVNF
E1 3 6 7 8 {GLFF}
R1 3 0 1E9
R2 3 0 1E9
R3 3 6 1E9
E2 6 4 5 0 10
R4 5 0 {RNVF}
R5 5 0 {RNVF}
R6 3 4 1E9
R7 4 0 1E9
G1 1 2 3 4 1E-6
.ENDS  FEMT_OPA1692
*
.SUBCKT GR_SRC_OPA1692 VC+ VC- IOUT+ IOUT- PARAMS: GAIN=1 IPOS=60E1 INEG=-60E1
G1 IOUT+ IOUT- VALUE={LIMIT(GAIN*V(VC+,VC-),INEG,IPOS)}
.ENDS  GR_SRC_OPA1692
*
.SUBCKT IQ_SRC_OPA1692 VC+ VC- IOUT+ IOUT- PARAMS: GAIN=1E-3
G1 IOUT+ IOUT- VALUE={IF( (V(VC+,VC-)<=0),0,GAIN*V(VC+,VC-) )}
.ENDS  IQ_SRC_OPA1692
*
.SUBCKT OL_SENSE_OPA1692 COM SW+ OLN OLP
GSW+ COM SW+ VALUE = {IF((V(OLN,COM)>10E-3 | V(OLP,COM)>10E-3),1,0)}
.ENDS  OL_SENSE_OPA1692
*
.SUBCKT SW_OL_OPA1692 SW_OL_OPA1692 MID CAP_L CAP_R
.MODEL OL_SW VSWITCH(RON=1E-3 ROFF=1E12 VON=900E-3 VOFF=800E-3)
S1 CAP_L CAP_R SW_OL_OPA1692 MID OL_SW
.ENDS  SW_OL_OPA1692
*
.SUBCKT VCM_CLAMP_OPA1692 VIN+ VIN- IOUT- IOUT+ VP+ VP- PARAMS: GAIN=1
G1 IOUT+ IOUT- VALUE={LIMIT(GAIN*V(VIN+,VIN-),V(VP-,VIN-), V(VP+,VIN-))}
.ENDS  VCM_CLAMP_OPA1692
*
.SUBCKT VNSE_OPA1692 1 2 PARAMS: FLW=0.1 GLF=1.016E-2 RNV=23.1014
.MODEL DVN D KF={PWR(FLW,0.5)/1E11} IS=1.0E-16
I1 0 7 10E-3
I2 0 8 10E-3
D1 7 0 DVN
D2 8 0 DVN
E1 3 6 7 8 {GLF}
R1 3 0 1E9
R2 3 0 1E9
R3 3 6 1E9
E2 6 4 5 0 10
R4 5 0 {RNV}
R5 5 0 {RNV}
R6 3 4 1E9
R7 4 0 1E9
E3 1 2 3 4 1
.ENDS  VNSE_OPA1692
*
.SUBCKT VOS_DRIFT_OPA1692 VOS+ VOS- PARAMS: DC=2.219E-04 POL=1 DRIFT=5.00E-07
E1 VOS+ VOS- VALUE={DC+POL*DRIFT*(TEMP-27)}
.ENDS  VOS_DRIFT_OPA1692
*
.SUBCKT ZO_SRC_OPA1692 VC+ VC- IOUT+ IOUT- PARAMS: GAIN=8000 IPOS=10E5 INEG=-10E5
G1 IOUT+ IOUT- VALUE={LIMIT(GAIN*V(VC+,VC-),INEG,IPOS)}
.ENDS  ZO_SRC_OPA1692
*
.backanno
.end